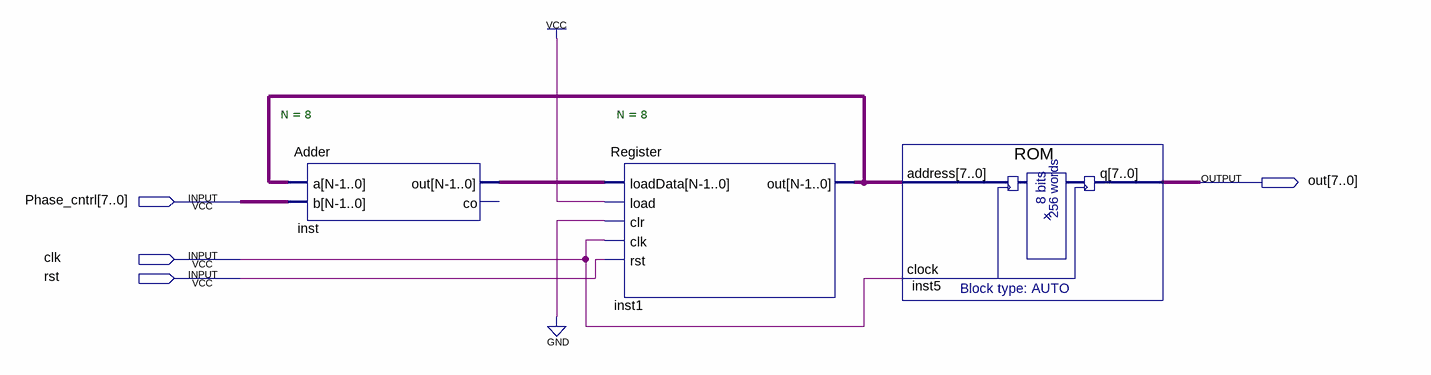
[diagram p0: schematic sheet]
// Quartus schematic DDS.bdf as structural Verilog: 3 symbols, 4 pins
module DDS (
  input  [7:0] Phase_cntrl,
  input  clk,
  input  rst,
  output [7:0] out
);

  wire [7:0] inst1_out, inst_out;

  Adder #(.N(8)) inst (.a(inst1_out), .b(Phase_cntrl), .out(inst_out));  // open: co
  Register #(.N(8)) inst1 (.loadData(inst_out), .load(1'b1), .clr(1'b0), .clk(clk), .rst(rst), .out(inst1_out));
  ROM inst5 (.address(inst1_out), .clock(clk), .q(out));
endmodule
